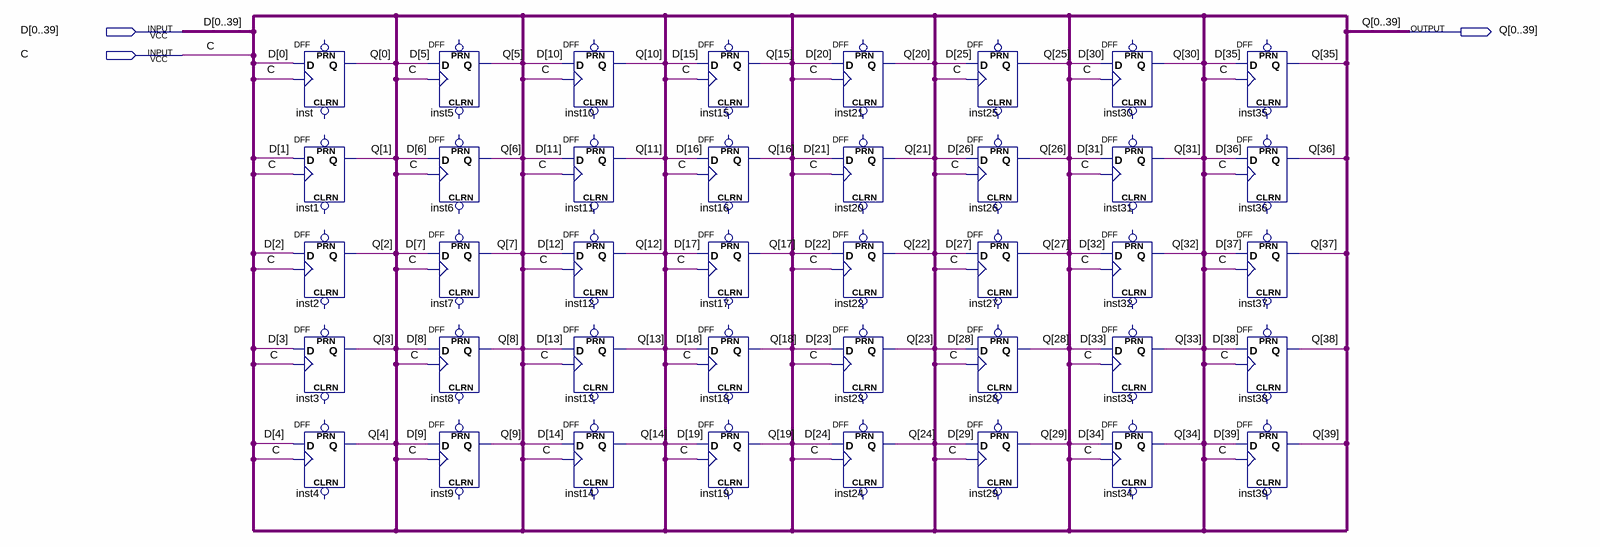
[diagram p0: schematic sheet]
// Quartus schematic Word.bdf as structural Verilog: 40 symbols, 3 pins
module Word (
  input  [0:39] D,
  input  C,
  output [0:39] Q
);

  DFF inst (.CLK(C), .D(D[0]), .Q(Q[0]));  // open: CLRN, PRN
  DFF inst1 (.CLK(C), .D(D[1]), .Q(Q[1]));  // open: CLRN, PRN
  DFF inst2 (.CLK(C), .D(D[2]), .Q(Q[2]));  // open: CLRN, PRN
  DFF inst3 (.CLK(C), .D(D[3]), .Q(Q[3]));  // open: CLRN, PRN
  DFF inst4 (.CLK(C), .D(D[4]), .Q(Q[4]));  // open: CLRN, PRN
  DFF inst5 (.CLK(C), .D(D[5]), .Q(Q[5]));  // open: CLRN, PRN
  DFF inst6 (.CLK(C), .D(D[6]), .Q(Q[6]));  // open: CLRN, PRN
  DFF inst7 (.CLK(C), .D(D[7]), .Q(Q[7]));  // open: CLRN, PRN
  DFF inst8 (.CLK(C), .D(D[8]), .Q(Q[8]));  // open: CLRN, PRN
  DFF inst9 (.CLK(C), .D(D[9]), .Q(Q[9]));  // open: CLRN, PRN
  DFF inst10 (.CLK(C), .D(D[10]), .Q(Q[10]));  // open: CLRN, PRN
  DFF inst11 (.CLK(C), .D(D[11]), .Q(Q[11]));  // open: CLRN, PRN
  DFF inst12 (.CLK(C), .D(D[12]), .Q(Q[12]));  // open: CLRN, PRN
  DFF inst13 (.CLK(C), .D(D[13]), .Q(Q[13]));  // open: CLRN, PRN
  DFF inst14 (.CLK(C), .D(D[14]), .Q(Q[14]));  // open: CLRN, PRN
  DFF inst15 (.CLK(C), .D(D[15]), .Q(Q[15]));  // open: CLRN, PRN
  DFF inst16 (.CLK(C), .D(D[16]), .Q(Q[16]));  // open: CLRN, PRN
  DFF inst17 (.CLK(C), .D(D[17]), .Q(Q[17]));  // open: CLRN, PRN
  DFF inst18 (.CLK(C), .D(D[18]), .Q(Q[18]));  // open: CLRN, PRN
  DFF inst19 (.CLK(C), .D(D[19]), .Q(Q[19]));  // open: CLRN, PRN
  DFF inst21 (.CLK(C), .D(D[20]), .Q(Q[20]));  // open: CLRN, PRN
  DFF inst20 (.CLK(C), .D(D[21]), .Q(Q[21]));  // open: CLRN, PRN
  DFF inst22 (.CLK(C), .D(D[22]), .Q(Q[22]));  // open: CLRN, PRN
  DFF inst23 (.CLK(C), .D(D[23]), .Q(Q[23]));  // open: CLRN, PRN
  DFF inst24 (.CLK(C), .D(D[24]), .Q(Q[24]));  // open: CLRN, PRN
  DFF inst25 (.CLK(C), .D(D[25]), .Q(Q[25]));  // open: CLRN, PRN
  DFF inst26 (.CLK(C), .D(D[26]), .Q(Q[26]));  // open: CLRN, PRN
  DFF inst27 (.CLK(C), .D(D[27]), .Q(Q[27]));  // open: CLRN, PRN
  DFF inst28 (.CLK(C), .D(D[28]), .Q(Q[28]));  // open: CLRN, PRN
  DFF inst29 (.CLK(C), .D(D[29]), .Q(Q[29]));  // open: CLRN, PRN
  DFF inst30 (.CLK(C), .D(D[30]), .Q(Q[30]));  // open: CLRN, PRN
  DFF inst31 (.CLK(C), .D(D[31]), .Q(Q[31]));  // open: CLRN, PRN
  DFF inst32 (.CLK(C), .D(D[32]), .Q(Q[32]));  // open: CLRN, PRN
  DFF inst33 (.CLK(C), .D(D[33]), .Q(Q[33]));  // open: CLRN, PRN
  DFF inst34 (.CLK(C), .D(D[34]), .Q(Q[34]));  // open: CLRN, PRN
  DFF inst35 (.CLK(C), .D(D[35]), .Q(Q[35]));  // open: CLRN, PRN
  DFF inst36 (.CLK(C), .D(D[36]), .Q(Q[36]));  // open: CLRN, PRN
  DFF inst37 (.CLK(C), .D(D[37]), .Q(Q[37]));  // open: CLRN, PRN
  DFF inst38 (.CLK(C), .D(D[38]), .Q(Q[38]));  // open: CLRN, PRN
  DFF inst39 (.CLK(C), .D(D[39]), .Q(Q[39]));  // open: CLRN, PRN
endmodule
